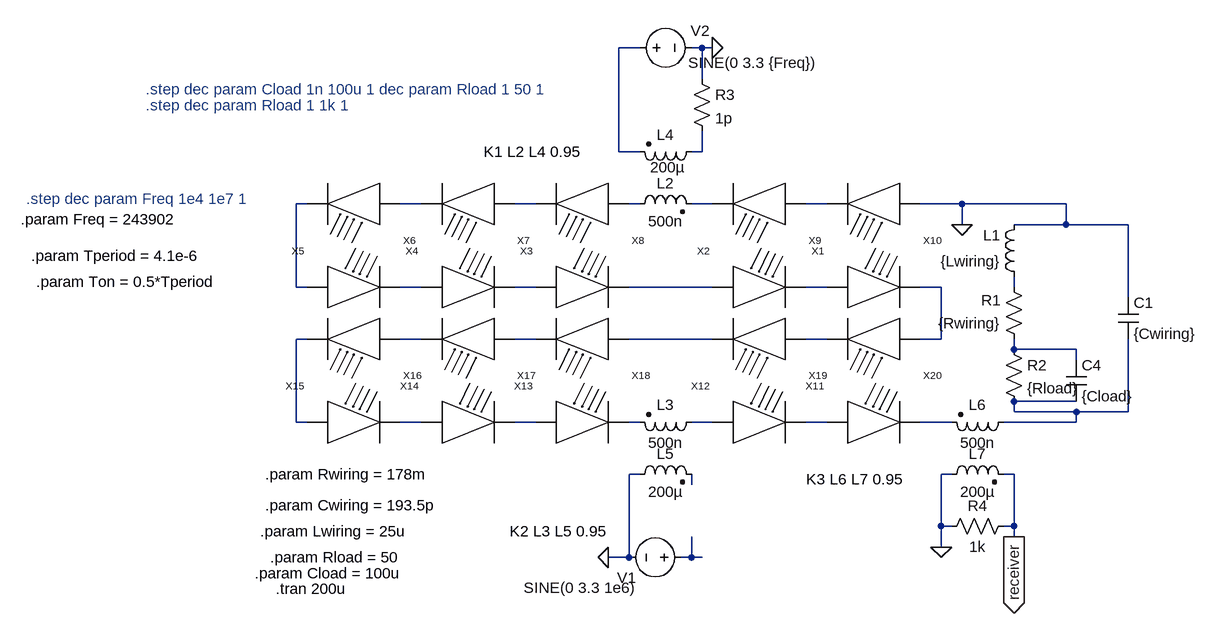
[diagram p0: schematic string.asc]
string.asc, the LTspice schematic file:
Version 4
SHEET 1 1588 680
WIRE -256 -544 -288 -544
WIRE -160 -544 -176 -544
WIRE -144 -544 -160 -544
WIRE -160 -496 -160 -544
WIRE -288 -384 -288 -544
WIRE -256 -384 -288 -384
WIRE -160 -384 -160 -416
WIRE -160 -384 -176 -384
WIRE -768 -304 -784 -304
WIRE -592 -304 -624 -304
WIRE -416 -304 -448 -304
WIRE -256 -304 -272 -304
WIRE -144 -304 -176 -304
WIRE 32 -304 0 -304
WIRE 240 -304 176 -304
WIRE 400 -304 240 -304
WIRE 240 -272 240 -304
WIRE 400 -272 400 -304
WIRE 400 -272 320 -272
WIRE 496 -272 400 -272
WIRE -784 -176 -784 -304
WIRE -768 -176 -784 -176
WIRE -592 -176 -624 -176
WIRE -416 -176 -448 -176
WIRE -144 -176 -272 -176
WIRE 32 -176 0 -176
WIRE 208 -176 176 -176
WIRE 320 -176 320 -192
WIRE 496 -160 496 -272
WIRE -768 -96 -784 -96
WIRE -592 -96 -624 -96
WIRE -416 -96 -448 -96
WIRE -144 -96 -272 -96
WIRE 32 -96 0 -96
WIRE 208 -96 208 -176
WIRE 208 -96 176 -96
WIRE 320 -80 320 -96
WIRE 416 -80 320 -80
WIRE 416 -64 416 -80
WIRE 416 0 320 0
WIRE 320 16 320 0
WIRE 416 16 320 16
WIRE 496 16 496 -96
WIRE 496 16 416 16
WIRE -784 32 -784 -96
WIRE -768 32 -784 32
WIRE -592 32 -624 32
WIRE -416 32 -448 32
WIRE -256 32 -272 32
WIRE -144 32 -176 32
WIRE 32 32 0 32
WIRE 224 32 176 32
WIRE 416 32 416 16
WIRE 416 32 304 32
WIRE -256 112 -272 112
WIRE 224 112 208 112
WIRE 320 112 304 112
WIRE -176 128 -176 112
WIRE 208 192 208 112
WIRE 224 192 208 192
WIRE 320 192 320 112
WIRE 320 192 304 192
WIRE 320 208 320 192
WIRE 208 224 208 192
WIRE -272 240 -272 112
WIRE -272 240 -304 240
WIRE -176 240 -176 208
WIRE -176 240 -192 240
WIRE -160 240 -176 240
FLAG 320 208 receiver
IOPIN 320 208 Out
FLAG -304 240 0
FLAG 240 -272 0
FLAG -144 -544 0
FLAG 208 224 0
SYMBOL cap 480 -160 R0
SYMATTR InstName C1
SYMATTR Value {Cwiring}
SYMBOL ind 336 -176 R180
WINDOW 0 36 80 Left 2
WINDOW 3 36 40 Left 2
SYMATTR InstName L1
SYMATTR Value {Lwiring}
SYMBOL voltage -176 240 R90
WINDOW 123 0 0 Left 2
WINDOW 39 63 85 VRight 2
WINDOW 0 31 85 VRight 2
WINDOW 3 47 85 VRight 2
SYMATTR InstName V1
SYMATTR Value SINE(0 3.3 1e6)
SYMBOL res 336 -80 R180
WINDOW 0 36 76 Left 2
WINDOW 3 36 40 Left 2
SYMATTR InstName R1
SYMATTR Value {Rwiring}
SYMBOL res 304 -96 R0
SYMATTR InstName R2
SYMATTR Value {Rload}
SYMBOL cap 400 -64 R0
SYMATTR InstName C4
SYMATTR Value {Cload}
SYMBOL jacModule 112 -304 R180
SYMATTR InstName X1
SYMBOL jacModule -64 -304 R180
SYMATTR InstName X2
SYMBOL jacModule -336 -304 R180
SYMATTR InstName X3
SYMBOL jacModule -512 -304 R180
SYMATTR InstName X4
SYMBOL jacModule -688 -304 R180
SYMATTR InstName X5
SYMBOL jacModule -704 -176 R0
SYMATTR InstName X6
SYMBOL jacModule -528 -176 R0
SYMATTR InstName X7
SYMBOL jacModule -352 -176 R0
SYMATTR InstName X8
SYMBOL jacModule -80 -176 R0
SYMATTR InstName X9
SYMBOL jacModule 96 -176 R0
SYMATTR InstName X10
SYMBOL jacModule 112 -96 R180
SYMATTR InstName X11
SYMBOL jacModule -64 -96 R180
SYMATTR InstName X12
SYMBOL jacModule -336 -96 R180
SYMATTR InstName X13
SYMBOL jacModule -512 -96 R180
SYMATTR InstName X14
SYMBOL jacModule -688 -96 R180
SYMATTR InstName X15
SYMBOL jacModule -704 32 R0
SYMATTR InstName X16
SYMBOL jacModule -528 32 R0
SYMATTR InstName X17
SYMBOL jacModule -352 32 R0
SYMATTR InstName X18
SYMBOL jacModule -80 32 R0
SYMATTR InstName X19
SYMBOL jacModule 96 32 R0
SYMATTR InstName X20
SYMBOL voltage -272 -544 R270
WINDOW 123 0 0 Left 2
WINDOW 39 15 85 VRight 2
WINDOW 0 26 95 VRight 2
WINDOW 3 -23 91 VRight 2
SYMATTR InstName V2
SYMATTR Value SINE(0 3.3 {Freq})
SYMBOL ind2 -272 -288 R270
WINDOW 0 32 56 VTop 2
WINDOW 3 5 56 VBottom 2
SYMATTR InstName L2
SYMATTR Value 500n
SYMATTR Type ind
SYMBOL ind2 -160 16 R90
WINDOW 0 5 56 VBottom 2
WINDOW 3 32 56 VTop 2
SYMATTR InstName L3
SYMATTR Value 500n
SYMATTR Type ind
SYMBOL ind2 -160 -400 R90
WINDOW 0 5 56 VBottom 2
WINDOW 3 24 53 VTop 2
SYMATTR InstName L4
SYMATTR Value 200µ
SYMATTR Type ind
SYMBOL ind2 -272 128 R270
WINDOW 0 32 56 VTop 2
WINDOW 3 5 56 VBottom 2
SYMATTR InstName L5
SYMATTR Value 200µ
SYMATTR Type ind
SYMBOL res -176 -512 R0
SYMATTR InstName R3
SYMATTR Value 1p
SYMBOL ind2 320 16 R90
WINDOW 0 5 56 VBottom 2
WINDOW 3 32 56 VTop 2
SYMATTR InstName L6
SYMATTR Value 500n
SYMATTR Type ind
SYMBOL ind2 208 128 R270
WINDOW 0 32 56 VTop 2
WINDOW 3 5 56 VBottom 2
SYMATTR InstName L7
SYMATTR Value 200µ
SYMATTR Type ind
SYMBOL res 320 176 R90
WINDOW 0 0 56 VBottom 2
WINDOW 3 32 56 VTop 2
SYMATTR InstName R4
SYMATTR Value 1k
TEXT -816 288 Left 2 !.tran 200u
TEXT -824 240 Left 2 !.param Rload = 50
TEXT -848 264 Left 2 !.param Cload = 100u
TEXT -832 160 Left 2 !.param Cwiring = 193.5p
TEXT -832 112 Left 2 !.param Rwiring = 178m
TEXT -840 200 Left 2 !.param Lwiring = 25u
TEXT -496 -384 Left 2 !K1 L2 L4 0.95
TEXT -456 200 Left 2 !K2 L3 L5 0.95
TEXT 0 120 Left 2 !K3 L6 L7 0.95
TEXT -1016 -456 Left 2 ;.step dec param Rload 1 1k 1
TEXT -1016 -480 Left 2 ;.step dec param Cload 1n 100u 1 dec param Rload 1 50 1
TEXT -1208 -280 Left 2 !.param Freq = 243902
TEXT -1200 -312 Left 2 ;.step dec param Freq 1e4 1e7 1
TEXT -1192 -224 Left 2 !.param Tperiod = 4.1e-6
TEXT -1184 -184 Left 2 !.param Ton = 0.5*Tperiod

The netlist it stands for:
* string.asc
C1 0 N021 {Cwiring}
L1 N014 0 {Lwiring}
V1 N029 0 SINE(0 3.3 1e6)
R1 N020 N014 {Rwiring}
R2 N020 N021 {Rload}
C4 N020 N021 {Cload}
XX1 0 N008 jacModule  ; pins modIN modOUT
XX2 N008 N007 jacModule  ; pins modIN modOUT
XX3 N006 N005 jacModule  ; pins modIN modOUT
XX4 N005 N004 jacModule  ; pins modIN modOUT
XX5 N004 N003 jacModule  ; pins modIN modOUT
XX6 N003 N009 jacModule  ; pins modIN modOUT
XX7 N009 N010 jacModule  ; pins modIN modOUT
XX8 N010 N011 jacModule  ; pins modIN modOUT
XX9 N011 N012 jacModule  ; pins modIN modOUT
XX10 N012 N013 jacModule  ; pins modIN modOUT
XX11 N013 N019 jacModule  ; pins modIN modOUT
XX12 N019 N018 jacModule  ; pins modIN modOUT
XX13 N018 N017 jacModule  ; pins modIN modOUT
XX14 N017 N016 jacModule  ; pins modIN modOUT
XX15 N016 N015 jacModule  ; pins modIN modOUT
XX16 N015 N022 jacModule  ; pins modIN modOUT
XX17 N022 N023 jacModule  ; pins modIN modOUT
XX18 N023 N024 jacModule  ; pins modIN modOUT
XX19 N025 N026 jacModule  ; pins modIN modOUT
XX20 N026 N027 jacModule  ; pins modIN modOUT
V2 N001 0 SINE(0 3.3 {Freq})
L2 N006 N007 500n
L3 N025 N024 500n
L4 N002 N001 200µ
L5 0 N028 200µ
R3 0 N002 1p
L6 N021 N027 500n
L7 0 receiver 200µ
R4 receiver 0 1k
.tran 200u
.param Rload = 50
.param Cload = 100u
.param Cwiring = 193.5p
.param Rwiring = 178m
.param Lwiring = 25u
K1 L2 L4 0.95
K2 L3 L5 0.95
K3 L6 L7 0.95
* .step dec param Rload 1 1k 1
* .step dec param Cload 1n 100u 1 dec param Rload 1 50 1
.param Freq = 243902
* .step dec param Freq 1e4 1e7 1
.param Tperiod = 4.1e-6
.param Ton = 0.5*Tperiod
.backanno
.end